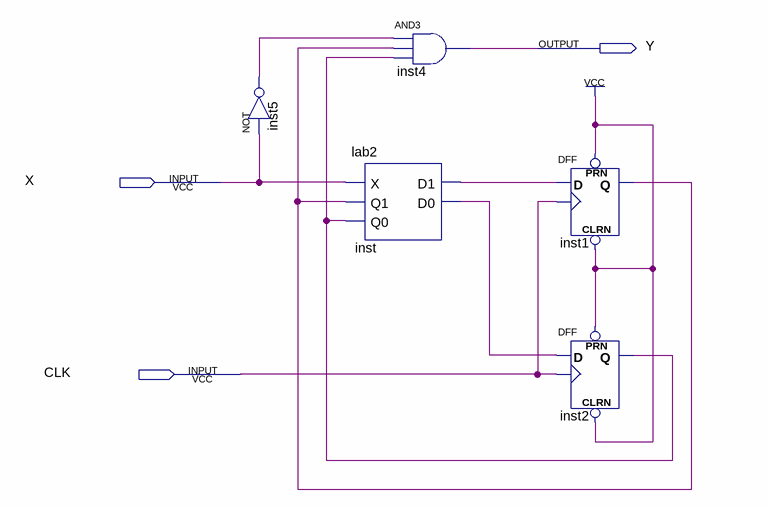
[diagram p0: schematic sheet]
// Quartus schematic Block2.bdf as structural Verilog: 5 symbols, 3 pins
module Block2 (
  input  X,
  input  CLK,
  output Y
);

  wire inst1_q, inst2_q, inst5_out, inst_d0, inst_d1;

  not inst5 (inst5_out, X);
  and inst4 (Y, inst5_out, inst1_q, inst2_q);
  lab2 inst (.X(X), .Q1(inst1_q), .Q0(inst2_q), .D1(inst_d1), .D0(inst_d0));
  DFF inst1 (.CLRN(1'b1), .CLK(CLK), .D(inst_d1), .PRN(1'b1), .Q(inst1_q));
  DFF inst2 (.CLRN(1'b1), .CLK(CLK), .D(inst_d0), .PRN(1'b1), .Q(inst2_q));
endmodule
